# EasyEDA schematic SCH_ODO_2025-04-28.json
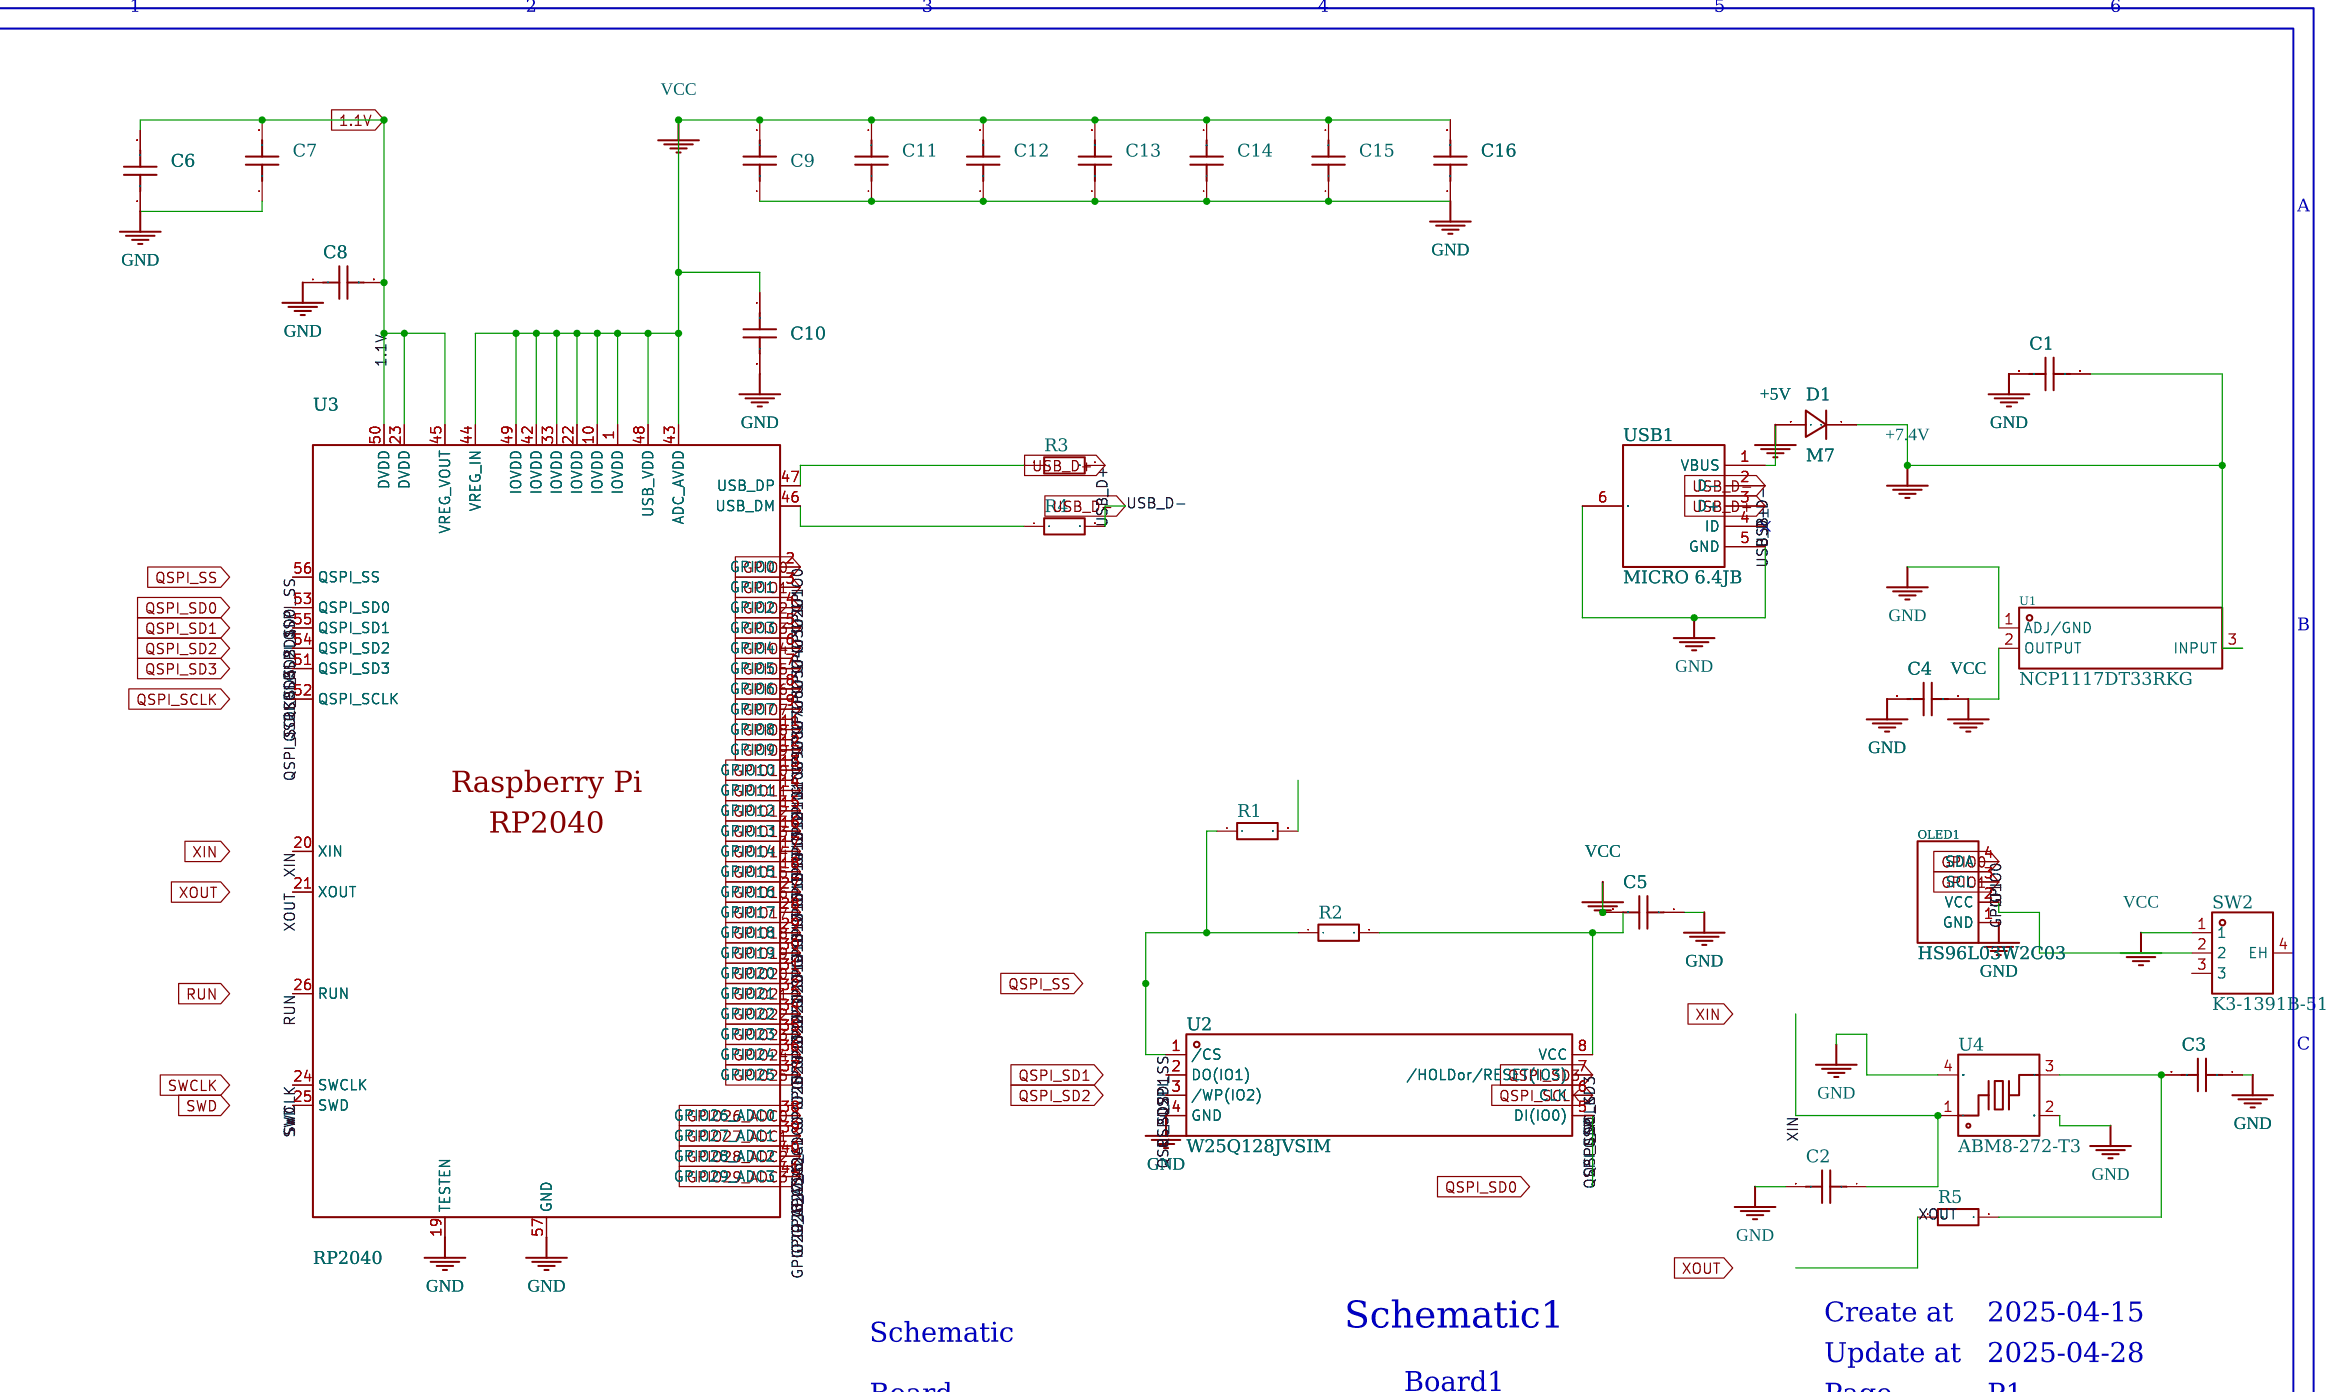
[diagram p0: schematic sheet]

## Parts
C1  10uF  [C0603]
C2  15pF  [C0603]
C3  15pF  [C0603]
C4  10uF  [C0603]
C5  100nF  [C0402]
C6  100nF  [C0402]
C7  100nF  [C0402]
C8  1uF  [C0402]
C9  100nF  [C0402]
C10  1uF  [C0402]
C11  100nF  [C0402]
C12  100nF  [C0402]
C13  100nF  [C0402]
C14  100nF  [C0402]
C15  100nF  [C0402]
C16  100nF  [C0402]
D1  M7  [SMA_L4.3-W2.6-LS5.2-RD]
OLED1  HS96L03W2C03  [OLED-TH_L27.8-W27.2-P2.54_C9900033791]
R1  1K  [R0603]
R2  10K  [R0603]
R3  27  [R0603]
R4  27  [R0603]
R5  1K  [R0603]
SW2  K3-1391B-51  [SW-TH_K3-1391B-51]
U1  NCP1117DT33RKG  [TO-252-2_L6.6-W6.1-P4.57-LS9.9-TL-CW]
U2  W25Q128JVSIM  [SOIC-8_L5.2-W5.2-P1.27-LS7.9-BL]
U3  RP2040  [LQFN-56_L7.0-W7.0-P0.4-EP]
U4  ABM8-272-T3  [CRYSTAL-SMD_4P-L3.2-W2.5-BL]
USB1  MICRO 6.4JB  [MICRO-USB-SMD_C2681558]

## Library data of the parts
C1-C4 = -: Symbol: CAP; Device: CAP_0603; Convert to PCB: yes; Add into BOM: yes; Supplier Footprint: 0603
C5-C7 C9 C11-C16 = -: Symbol: CAP; Device: CL05B104KO5NNNC; LCSC Part Name: 100nF ±10% 16V; Supplier Part: C1525; Manufacturer: SAMSUNG(三星); Manufacturer Part: CL05B104KO5NNNC; Supplier Footprint: 0402; JLCPCB Part Class: Basic Part; Datasheet: https://atta.szlcsc.com/upload/public/pdf/source/20160218/1457707763339.pdf; Supplier: LCSC; Add into BOM: yes; Convert to PCB: yes; Tolerance: ±10%
C8 C10 = -: Symbol: C0402X6S105K6R3NT; Device: CL05A105KA5NQNC; LCSC Part Name: 1uF ±10% 25V; Supplier Part: C52923; Manufacturer: SAMSUNG(三星); Manufacturer Part: CL05A105KA5NQNC; Supplier Footprint: 0402; JLCPCB Part Class: Basic Part; Datasheet: https://atta.szlcsc.com/upload/public/pdf/source/20160218/1457707763339.pdf; Supplier: LCSC; Add into BOM: yes; Convert to PCB: yes; Tolerance: ±10%
D1 = -: Symbol: M7_C95872; Device: M7_C95872; LCSC Part Name: 电压:1kV 电流:1A; Supplier Part: C95872; Manufacturer: MDD(辰达半导体); Supplier Footprint: SMA(DO-214AC); JLCPCB Part Class: Basic Part; Datasheet: https://atta.szlcsc.com/upload/public/pdf/source/20230314/2A19294A7E86AE073FE0E8B47BC771B8.pdf; Supplier: LCSC; Add into BOM: yes; Convert to PCB: yes; Forward Voltage (Vf@If): 1.1V@1A; Reverse Leakage Current: 5uA@1kV
OLED1 = -: Symbol: HS91L02W2C01; Supplier: LCSC; Supplier Part: C5248080; Manufacturer: HS(汉昇); JLCPCB Part Class: Extended Part; LCSC Part Name: 0.96寸OLED显示屏窄白光IIC; Datasheet: https://atta.szlcsc.com/upload/public/pdf/source/20230627/763D01F79A90007632F098068C7C8AD9.pdf; Add into BOM: yes; Convert to PCB: yes; Main Control Chip: SSD1315; Interface Type: I2C; Size: 0.96; Pixel Resolution: 128x64; Operating Temperature: -40℃+70℃
R1-R5 = -: Symbol: Res; Device: Res_0603; Convert to PCB: yes; Add into BOM: yes; Supplier Footprint: 0603
SW2 = -: LCSC Part Name: 卧插双档 滑动开关; Supplier Part: C92656; Manufacturer: 韩国韩荣; Supplier Footprint: 插件; JLCPCB Part Class: Extended Part; Datasheet: https://atta.szlcsc.com/upload/public/pdf/source/20200417/C92656_C9D6734602329AAA248C31EF7FB16FDE.pdf; Supplier: LCSC; Add into BOM: yes; Convert to PCB: yes; Circuit: Single Pole Double Throw (SPDT); Actuator Style: Rectangular column; Pin Style: PCPin; Switch Length: 13.3mm; Switch Width: 6mm; Switch Height: 6.6mm; Actuator Color: Black; Current Rating (AC): 5A; Voltage Rating (AC): 120V; Mechanical Life: 30,000 Times; Operating Temperature: -25℃+80℃
U1 = -: Supplier: LCSC; Manufacturer: onsemi(安森美); Supplier Part: C88234; JLCPCB Part Class: Extended Part; LCSC Part Name: 输入20V 输出3.3V 1A; Supplier Footprint: TO-252-2(DPAK); Datasheet: https://atta.szlcsc.com/upload/public/pdf/source/20180713/C233237_751C9E9ABCFEB70C62A2D3109B40BDA0.pdf; Add into BOM: yes; Convert to PCB: yes; Maximum Input Voltage: 20V; Output Voltage: 3.3V; MAX Output Current: 1A; Power Supply Rejection Ratio (PSRR): 64dB@(120Hz); Dropout Voltage: 1.2V@(800mA); standby current: 10mA; Operating Temperature: 0℃+125℃; Output Polarity: Positive electrode; Number of Outputs: 1
U2 = -: Supplier Part: C2613930; Manufacturer: WINBOND(华邦); Supplier Footprint: SOIC-8-208mil; JLCPCB Part Class: Extended Part; Datasheet: https://atta.szlcsc.com/upload/public/pdf/source/20210412/84C68860639CE6E99E4DBE9DB39E5296.pdf; Supplier: LCSC; Add into BOM: yes; Convert to PCB: yes; Interface Type: SPI; Memory Size: 128Mbit; Supply Voltage: 2.7V3.6V; Page Programming Time (Tpp): 3ms; Operating Temperature: -40℃+85℃
U3 = -: Device: RP2040_C2040; LCSC Part Name: RP2040（RP2B2）; Supplier Part: C2040; Manufacturer: Raspberry Pi(树莓派); Supplier Footprint: LQFN-56(7x7); JLCPCB Part Class: Extended Part; Datasheet: https://atta.szlcsc.com/upload/public/pdf/source/20210621/C2040_96F425825606B7957D87DD32E2512CA9.pdf; Supplier: LCSC; Add into BOM: yes; Convert to PCB: yes; CPU Maximum Speed: 133MHz; Number of I/O: 30; ADC (Bit): 12bit
U4 = -: Symbol: ABM8-272-T3_C20625731; Device: ABM8-272-T3_C20625731; Supplier Part: C20625731; Manufacturer: ABRACON; Supplier Footprint: SMD3225-4P; JLCPCB Part Class: Extended Part; Datasheet: https://atta.szlcsc.com/upload/public/pdf/source/20240227/A8BE43F636D80F75C9AF5C59EDF21E9A.pdf; Supplier: LCSC; Add into BOM: yes; Convert to PCB: yes
USB1 = -: LCSC Part Name: Micro-B 母 卧贴; Supplier Part: C2681558; Manufacturer: SHOU HAN(首韩); Supplier Footprint: SMD; JLCPCB Part Class: Extended Part; Datasheet: https://atta.szlcsc.com/upload/public/pdf/source/20210107/C2681558_CE87DAC76B0B6D6A8499512BD182790B.pdf; Supplier: LCSC; Add into BOM: yes; Convert to PCB: yes; Connector Type: Micro-B; Standard: USB 2.0; Gender: Female; Mounting Style: Horizontal attachment; Number of Contacts: 5P; Number of Ports: 1; Current Rating - Power (Max): 1A; Operating Temperature Range: -20℃+65℃; Connect-Disconnect Life: 10,000 times; Core Colour: Black

## Nets
1.1V: C6.2 C7.2 C8.2 U3.23(DVDD) U3.45(VREG_VOUT) U3.50(DVDD)
+5V: D1.2(A) USB1.1(VBUS)
+7.4V: C1.1 D1.1(K) U1.3(INPUT)
GND: C1.2 C2.2 C3.1 C4.2 C5.1 C6.1 C7.1 C8.1 C9.1 C10.2 C11.1 C12.1 C13.1 C14.1 C15.1 C16.1 OLED1.1(GND) U1.1(ADJ/GND) U2.4(GND) U3.19(TESTEN) U3.57(GND) U4.2(GND) U4.4(GND) USB1.5(GND) USB1.6(EH)
VCC: C4.1 C5.2 C9.2 C10.1 C11.2 C12.2 C13.2 C14.2 C15.2 C16.2 R2.2 SW2.1 U1.2(OUTPUT) U2.8(VCC) U3.1(IOVDD) U3.10(IOVDD) U3.22(IOVDD) U3.33(IOVDD) U3.42(IOVDD) U3.43(ADC_AVDD) U3.44(VREG_IN) U3.48(USB_VDD) U3.49(IOVDD)
GPIO0: OLED1.4(SDA) U3.2(GPIO0)
GPIO1: OLED1.3(SCL) U3.3(GPIO1)
GPIO2: U3.4(GPIO2)
GPIO3: U3.5(GPIO3)
GPIO4: U3.6(GPIO4)
GPIO5: U3.7(GPIO5)
GPIO6: U3.8(GPIO6)
GPIO7: U3.9(GPIO7)
GPIO8: U3.11(GPIO8)
GPIO9: U3.12(GPIO9)
GPIO10: U3.13(GPIO10)
GPIO11: U3.14(GPIO11)
GPIO12: U3.15(GPIO12)
GPIO13: U3.16(GPIO13)
GPIO14: U3.17(GPIO14)
GPIO15: U3.18(GPIO15)
GPIO16: U3.27(GPIO16)
GPIO17: U3.28(GPIO17)
GPIO18: U3.29(GPIO18)
GPIO19: U3.30(GPIO19)
GPIO20: U3.31(GPIO20)
GPIO21: U3.32(GPIO21)
GPIO22: U3.34(GPIO22)
GPIO23: U3.35(GPIO23)
GPIO24: U3.36(GPIO24)
GPIO25: U3.37(GPIO25)
GPIO26_ADC0: U3.38(GPIO26_ADC0)
GPIO27_ADC1: U3.39(GPIO27_ADC1)
GPIO28_ADC2: U3.40(GPIO28_ADC2)
GPIO29_ADC3: U3.41(GPIO29_ADC3)
QSPI_SCLK: U2.6(CLK) U3.52(QSPI_SCLK)
QSPI_SD0: U2.5(DI(IO0)) U3.53(QSPI_SD0)
QSPI_SD1: U2.2(DO(IO1)) U3.55(QSPI_SD1)
QSPI_SD2: U2.3(/WP(IO2)) U3.54(QSPI_SD2)
QSPI_SD3: U2.7(/HOLDor/RESET(IO3)) U3.51(QSPI_SD3)
QSPI_SS: R1.1 R2.1 U2.1(/CS) U3.56(QSPI_SS)
RUN: U3.26(RUN)
SWCLK: U3.24(SWCLK)
SWD: U3.25(SWD)
USB_D+: R3.2 USB1.3(D+)
USB_D-: R4.2 USB1.2(D-)
XIN: C2.1 U3.20(XIN) U4.1
XOUT: R5.1 U3.21(XOUT)
Net-(C3-2): C3.2 R5.2 U4.3
Net-(OLED1-2): OLED1.2(VCC) SW2.2
Net-(R3-1): R3.1 U3.47(USB_DP)
Net-(R4-1): R4.1 U3.46(USB_DM)

Not connected (* = marked no-connect by the designer): R1 2; SW2 3 4(EH); USB1 4(ID)*

## Notes on the sheet
- 1
- 2
- 3
- 4
- 5
- 6
- A
- A
- B
- B
- C
- C
- Schematic1
- Create at
- 2025-04-15
- Schematic
- Update at
- 2025-04-28
- Board1
- Board
- Page
- P1
- Drawn
- ODO
- D
- Reviewed
- D
- Version
- Size
- Page  1  Total  2
- V1.0
- A4
- EasyEDA.com
- 1
- 2
- 3
- 4
- 5
- 6
